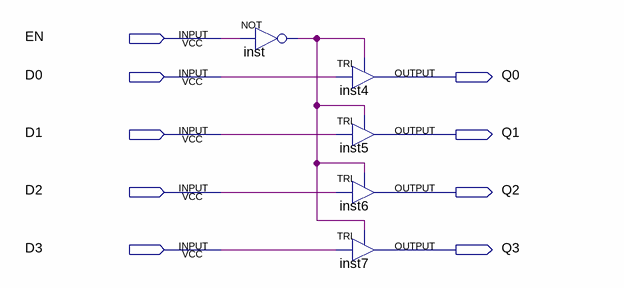
[diagram p0: schematic sheet]
// Quartus schematic 4tristate.bdf as structural Verilog: 5 symbols, 9 pins
module \4tristate  (
  input  EN,
  input  D0,
  input  D1,
  input  D2,
  input  D3,
  output Q0,
  output Q1,
  output Q2,
  output Q3
);

  wire inst_out;

  not inst (inst_out, EN);
  TRI inst4 (.IN(D0), .OE(inst_out), .OUT(Q0));
  TRI inst5 (.IN(D1), .OE(inst_out), .OUT(Q1));
  TRI inst6 (.IN(D2), .OE(inst_out), .OUT(Q2));
  TRI inst7 (.IN(D3), .OE(inst_out), .OUT(Q3));
endmodule
